# EAGLE design modem_arduino_relay (EAGLE 7.2.0)
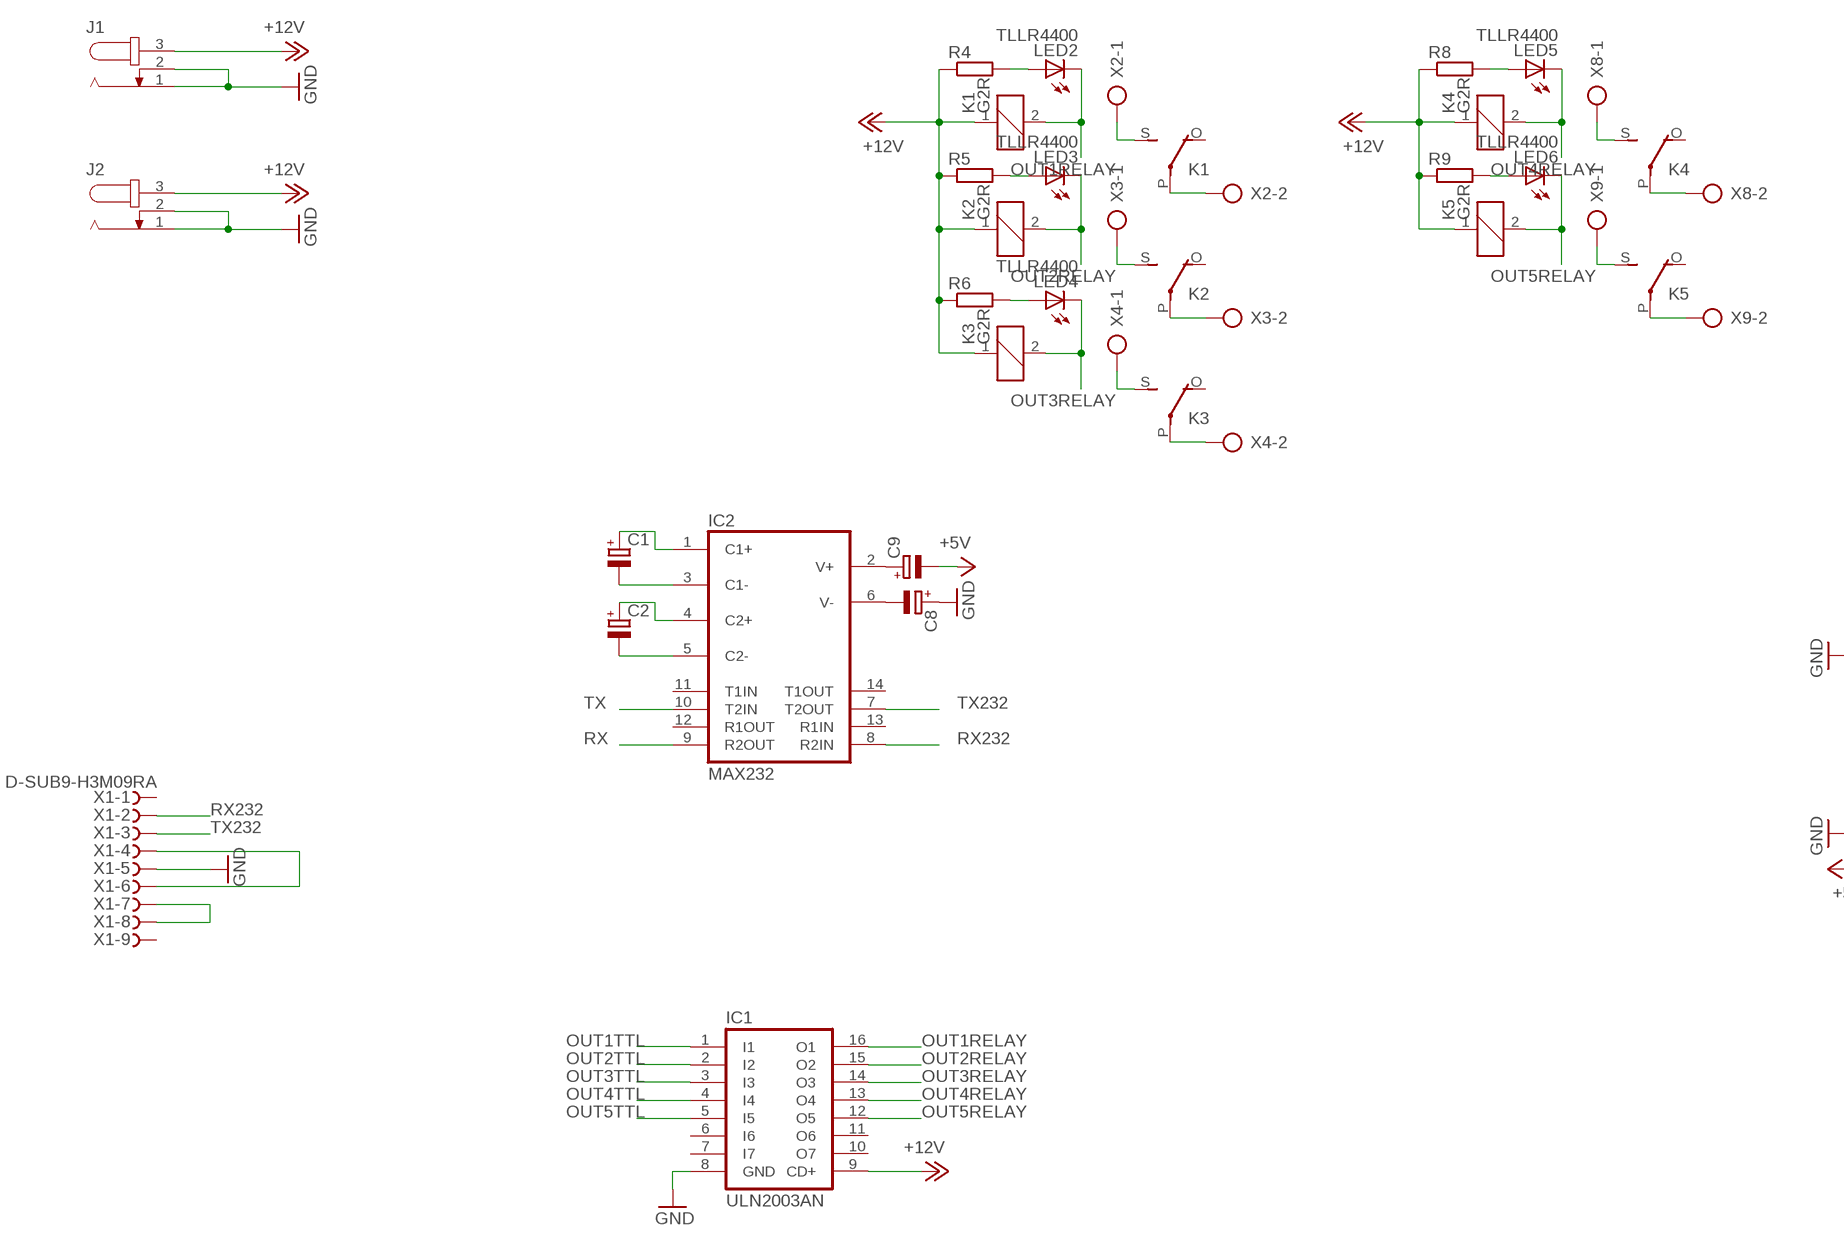
[diagram p0: schematic, sheet 1, part 1 of 2]
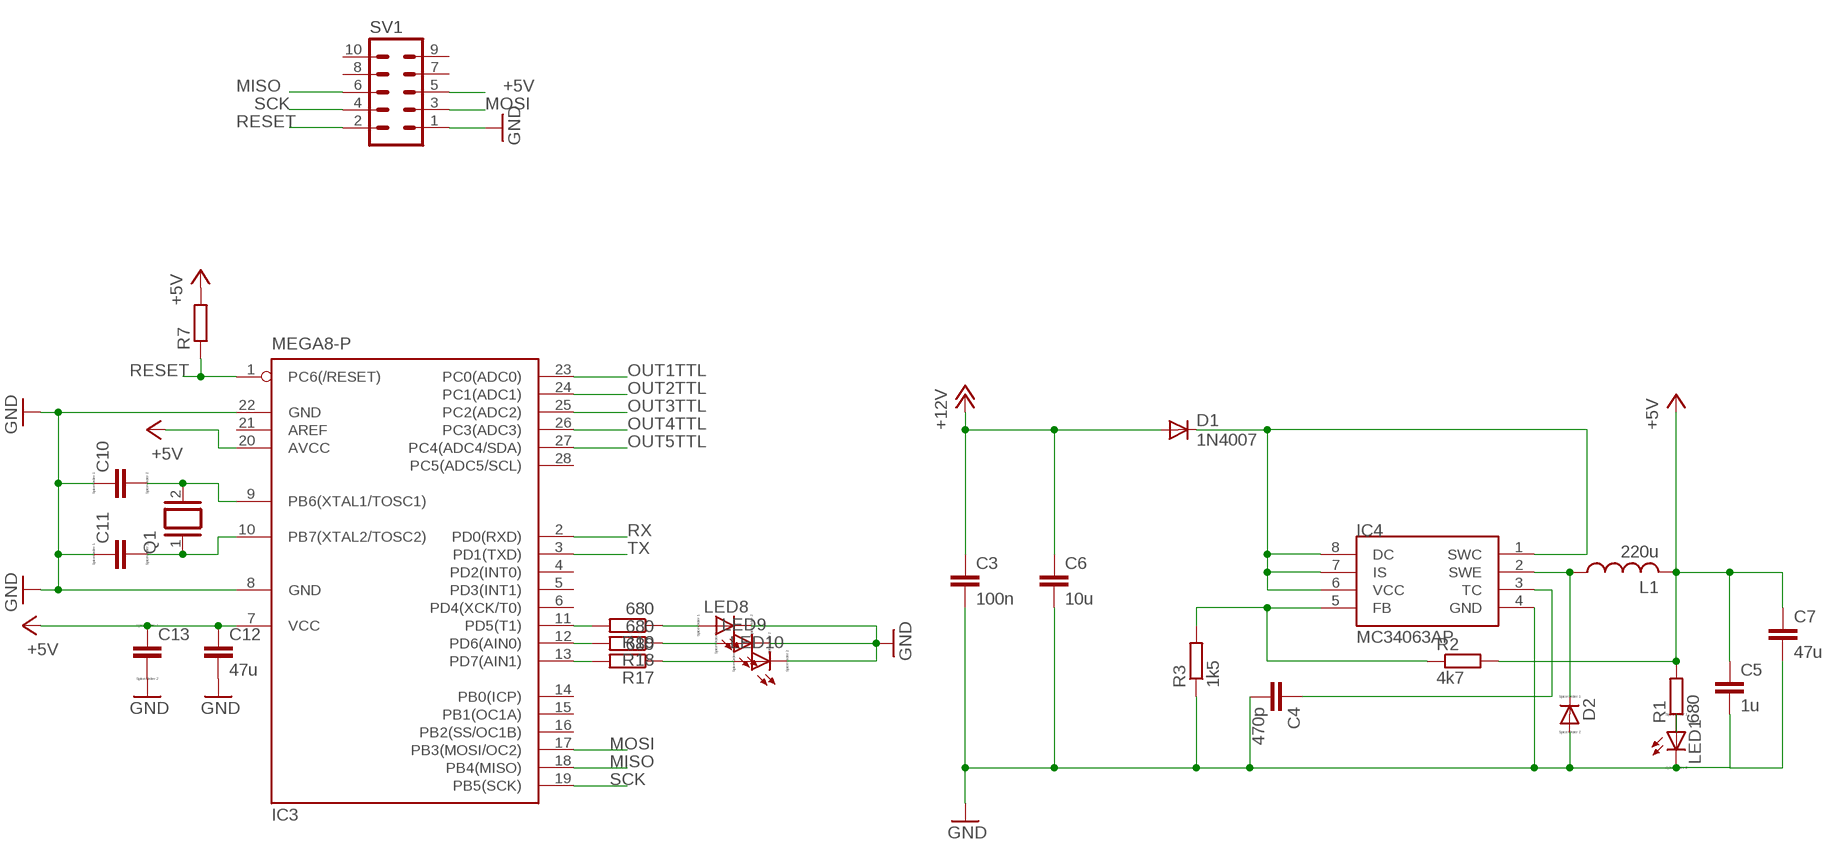
[diagram p1: schematic, sheet 1, part 2 of 2]

## Parts
C1  CPOL-EUE2.5-5  [E2,5-5]
C2  CPOL-EUE2.5-5  [E2,5-5]
C3  100n  C-EUC1206  [C1206]
C4  470p  C-EUC1206  [C1206]
C5  1u  C-EUC1206  [C1206]
C6  10u  C-EU050-024X044  [C050-024X044]
C7  47u  C-EU050-024X044  [C050-024X044]
C8  CPOL-EUE2.5-5  [E2,5-5]
C9  CPOL-EUE2.5-5  [E2,5-5]
C10  C-EUC1206  [C1206]
C11  C-EUC1206  [C1206]
C12  47u  C-EUC1812  [C1812]
C13  C-EUC1206  [C1206]
D1  1N4007  1N4004  [DO41-10]
D2  DIODE_E-SMC  [DIODE_SMC]
IC1  ULN2003AN  [DIL16]
IC2  MAX232  [DIL16]
IC3  MEGA8-P  [DIL28-3]
IC4  MC34063AP  [DIL08]
J1  JACK-PLUG1  [SPC4078]
J2  JACK-PLUG1  [SPC4078]
K1  G2R  [G2R]
K2  G2R  [G2R]
K3  G2R  [G2R]
K4  G2R  [G2R]
K5  G2R  [G2R]
L1  220u  L-USTJ3-U1  [TJ3-U1]
LED1  LED_ELD260  [LED_LD260]
LED2  TLLR4400  [LED3MM]
LED3  TLLR4400  [LED3MM]
LED4  TLLR4400  [LED3MM]
LED5  TLLR4400  [LED3MM]
LED6  TLLR4400  [LED3MM]
LED8  LED_ELD260  [LED_LD260]
LED9  LED_ELD260  [LED_LD260]
LED10  LED_ELD260  [LED_LD260]
Q1  XTAL/S  [QS]
R1  680  R-EU_M1206  [M1206]
R2  4k7  R-EU_0204/7  [0204/7]
R3  1k5  R-EU_0204/7  [0204/7]
R4  R-EU_M1206  [M1206]
R5  R-EU_M1206  [M1206]
R6  R-EU_M1206  [M1206]
R7  R-EU_M1206  [M1206]
R8  R-EU_M1206  [M1206]
R9  R-EU_M1206  [M1206]
R17  680  R-EU_M1206  [M1206]
R18  680  R-EU_M1206  [M1206]
R19  680  R-EU_M1206  [M1206]
SV1  MA05-2  [MA05-2]
X1  D-SUB9-H3M09RA  [H3M09RA]
X2  AK300/2  [AK300/2]
X3  AK300/2  [AK300/2]
X4  AK300/2  [AK300/2]
X8  AK300/2  [AK300/2]
X9  AK300/2  [AK300/2]

## Nets
+5V: C12.1 C13.1 IC3.7(VCC) IC3.20(AVCC) R7.2 SV1.5
+12V: C3.1 C6.1 D1.A IC1.9(CD+) J1.3 J2.3 K1.1 K2.1 K3.1 K4.1 K5.1 R4.1 R5.1 R6.1 R8.1 R9.1
GND: C3.2 C4.2 C5.2 C6.2 C7.2 C8.+ C10.1 C11.1 C12.2 C13.2 D2.A(C) IC1.8(GND) IC3.8(GND) IC3.22(GND) IC4.4(GND) J1.1 J1.2 J2.1 J2.2 LED1.K(C) LED8.K(C) LED9.K(C) LED10.K(C) R3.1 SV1.1 X1.5
MISO: IC3.18(PB4(MISO)) SV1.6
MOSI: IC3.17(PB3(MOSI/OC2)) SV1.3
N$1: C1.+ IC2.1(C1+)
N$2: C1.- IC2.3(C1-)
N$3: C2.+ IC2.4(C2+)
N$4: C2.- IC2.5(C2-)
N$5: D1.C IC4.1(SWC) IC4.6(VCC) IC4.7(IS) IC4.8(DC)
N$6: LED1.A R1.1
N$7: IC4.5(FB) R2.1 R3.2
N$8: C4.1 IC4.3(TC)
N$9: D2.C(A) IC4.2(SWE) L1.1
N$10: C8.- IC2.6(V-)
N$11: C9.+ IC2.2(V+)
N$12: C11.2 IC3.10(PB7(XTAL2/TOSC2)) Q1.1
N$13: K1.S(2:S) X2.1
N$14: K1.P(2:P) X2.2
N$15: C10.2 IC3.9(PB6(XTAL1/TOSC1)) Q1.2
N$16: K2.P(2:P) X3.2
N$17: K2.S(2:S) X3.1
N$18: K3.S(2:S) X4.1
N$19: K3.P(2:P) X4.2
N$20: LED2.A R4.2
N$21: LED4.A R6.2
N$22: LED3.A R5.2
N$24: K4.S(2:S) X8.1
N$25: K4.P(2:P) X8.2
N$26: K5.P(2:P) X9.2
N$27: K5.S(2:S) X9.1
N$31: IC3.11(PD5(T1)) R19.2
N$36: IC3.12(PD6(AIN0)) R18.2
N$37: IC3.13(PD7(AIN1)) R17.2
N$38: LED8.A R19.1
N$39: LED9.A R18.1
N$40: LED10.A R17.1
N$41: X1.7 X1.8
N$42: X1.4 X1.6
N$45: LED5.A R8.2
N$47: LED6.A R9.2
OUT1RELAY: IC1.16(O1) K1.2 LED2.K(C)
OUT1TTL: IC1.1(I1) IC3.23(PC0(ADC0))
OUT2RELAY: IC1.15(O2) K2.2 LED3.K(C)
OUT2TTL: IC1.2(I2) IC3.24(PC1(ADC1))
OUT3RELAY: IC1.14(O3) K3.2 LED4.K(C)
OUT3TTL: IC1.3(I3) IC3.25(PC2(ADC2))
OUT4RELAY: IC1.13(O4) K4.2 LED5.K(C)
OUT4TTL: IC1.4(I4) IC3.26(PC3(ADC3))
OUT5RELAY: IC1.12(O5) K5.2 LED6.K(C)
OUT5TTL: IC1.5(I5) IC3.27(PC4(ADC4/SDA))
RESET: IC3.1(PC6(/RESET)) R7.1 SV1.2
RX: IC2.9(R2OUT) IC3.2(PD0(RXD))
RX232: IC2.8(R2IN) X1.2
SCK: IC3.19(PB5(SCK)) SV1.4
TX: IC2.10(T2IN) IC3.3(PD1(TXD))
TX232: IC2.7(T2OUT) X1.3
VCC: C5.1 C7.1 C9.- L1.2 R1.2 R2.2 ; supply symbol labelled +5V
Unconnected: IC1.6(I6) IC1.7(I7) IC1.10(O7) IC1.11(O6) IC2.11(T1IN) IC2.12(R1OUT) IC2.13(R1IN) IC2.14(T1OUT) IC3.4(PD2(INT0)) IC3.5(PD3(INT1)) IC3.6(PD4(XCK/T0)) IC3.14(PB0(ICP)) IC3.15(PB1(OC1A)) IC3.16(PB2(SS/OC1B)) IC3.21(AREF) IC3.28(PC5(ADC5/SCL)) K1.O(2:O) K2.O(2:O) K3.O(2:O) K4.O(2:O) K5.O(2:O) SV1.7 SV1.8 SV1.9 SV1.10 X1.1 X1.9

## Power pins joined to a net without a drawn wire
GND: IC2.15(GND)
VCC: IC2.16(VCC)

## Library data of the parts
C1 C2 C8 C9 = rcl:CPOL-EU: POLARIZED CAPACITOR, European symbol
C3-C7 C12 = rcl:C-EU: CAPACITOR, European symbol
C10 C11 C13 = resistor:C-EU: CAPACITOR, European symbol; SPICEPREFIX: C
D1 = diode:1N4004: DIODE general purpose rectifier, 1 A
D2 = eagle-ltspice:DIODE_E-: Schottky Diode; SPICEMODEL: diode; SPICEPREFIX: D
IC1 = uln-udn:ULN2003A: DRIVER ARRAY
IC2 = maxim:MAX232: RS232 TRANSCEIVER; MF: MAXIM; MPN: MAX232ACPE+; OC_FARNELL: 9723773; OC_NEWARK: 68K4544
IC3 = atmel:MEGA8-P: MICROCONTROLLER 8 Kbytes FLASH, 1 kbytes SRAM, 512 bytes EEPROM, USART, 4-channel 10 bit ADC, 2-channel 8 bit ADC Pin compatible with Atmega48, ATMega88, ATMega168 Source: avr.lbr; OC_FARNELL: unknown; OC_NEWARK: unknown
IC4 = mc34063:MC34063
J1 J2 = con-jack:JACK-PLUG: DC POWER JACK Power Jack, DC, Right Angle, Through Hole, Rated 5A at 16VDC, PC Terminals Distributor: Farnell (www.Farnell.de) Drawing: 84N1161.pdf / 84N1162.pdf Manufacturer: SPC Technology (www.spctechnology.com) Type: SPC4077 / SPC 4078; OC_FARNELL: unknown; OC_NEWARK: unknown
K1-K5 = relay:G2R: RELAY 1 x switch, Omron; OC_FARNELL: 1569185; OC_NEWARK: unknown
L1 = rcl:L-US: INDUCTOR, American symbol
LED1 LED8-LED10 = eagle-ltspice:LED_E: LED Source: http://www.osram.convergy.de Source: www.luxeon.com Source: www.kingbright.com; SPICEMODEL: NONE; SPICEPREFIX: D; SPICETYPE: diode
LED2-LED6 = led:TLLR4400: Low Current (2mA) LED 3 mm Tinted Diffused Package color RED Source: Data sheet <http://www.farnell.com/datasheets/391100.pdf>; MF: VISHAY SEMICONDUCTOR; OC_FARNELL: 1612437
Q1 = special:XTAL/S: CRYSTAL
R1-R9 R17-R19 = rcl:R-EU_: RESISTOR, European symbol
SV1 = con-lstb:MA05-2: PIN HEADER; OC_FARNELL: unknown; OC_NEWARK: unknown
X1 = con-thomas-betts:D-SUB9-: D-Subminiatur Connector Source: Electronioc Interconnects European Edition 1998; OC_FARNELL: unknown; OC_NEWARK: unknown
X2-X4 X8 X9 = con-ptr500:AK300/2: CONNECTOR; OC_FARNELL: unknown; OC_NEWARK: unknown

## Board
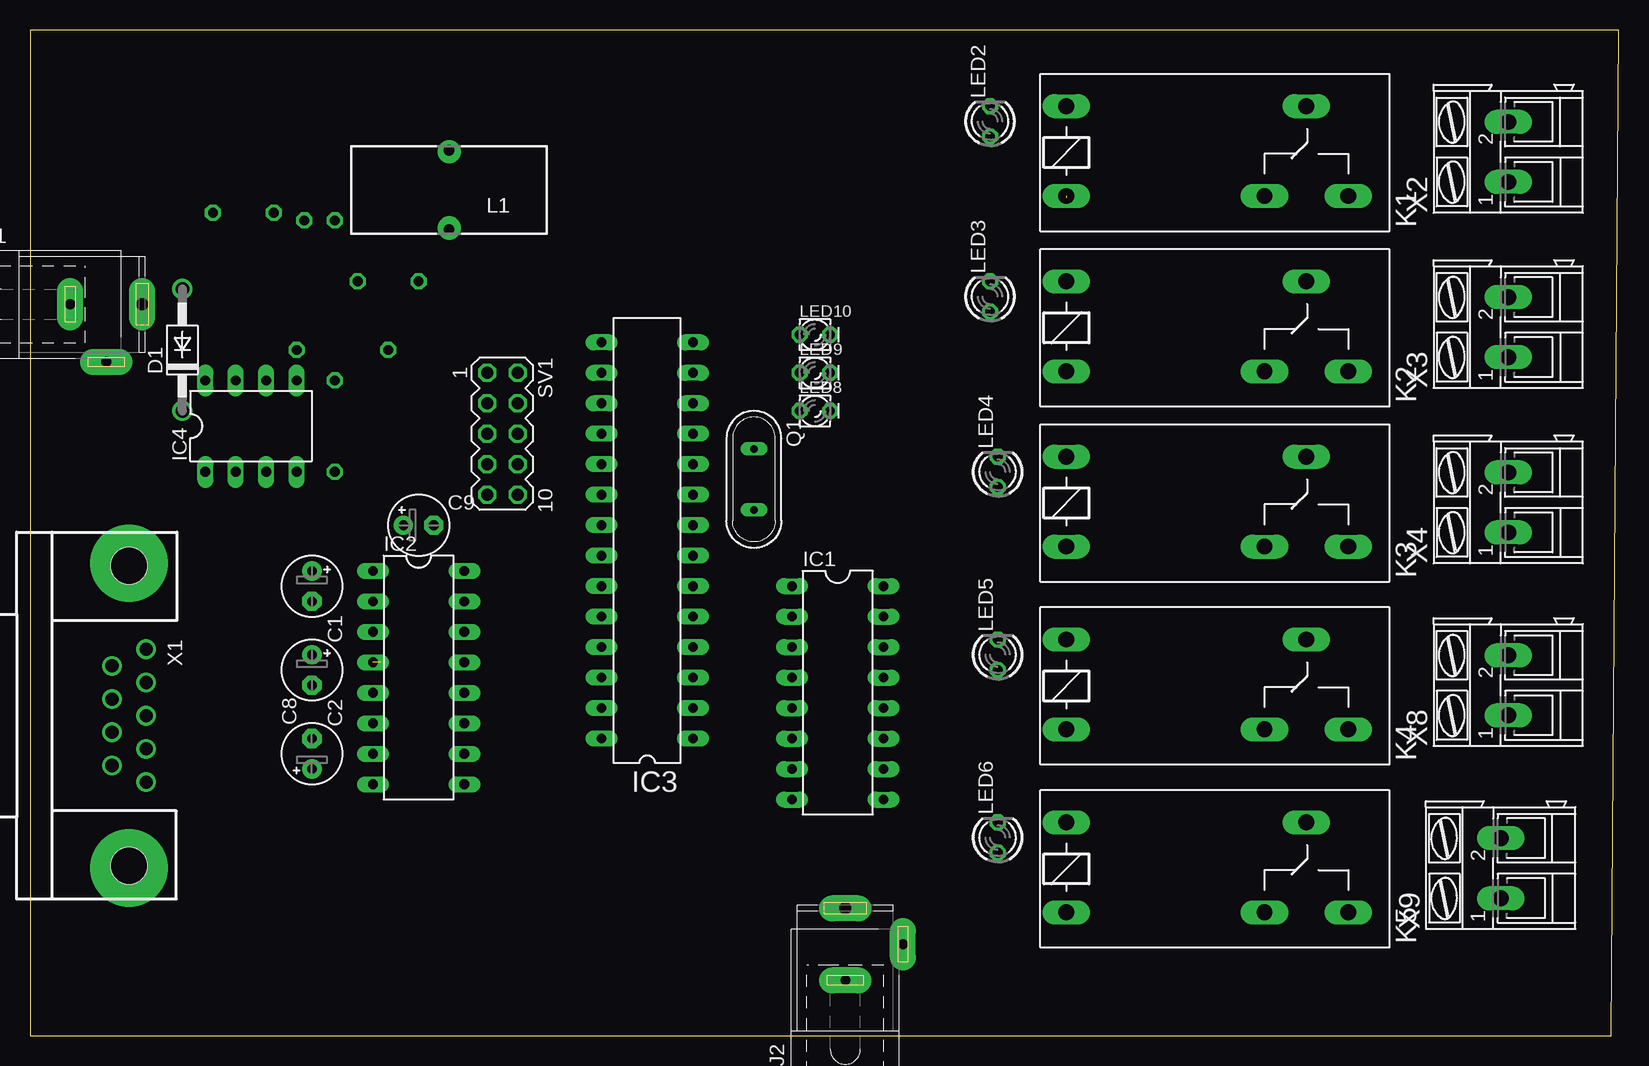
[diagram p2: board, top side]
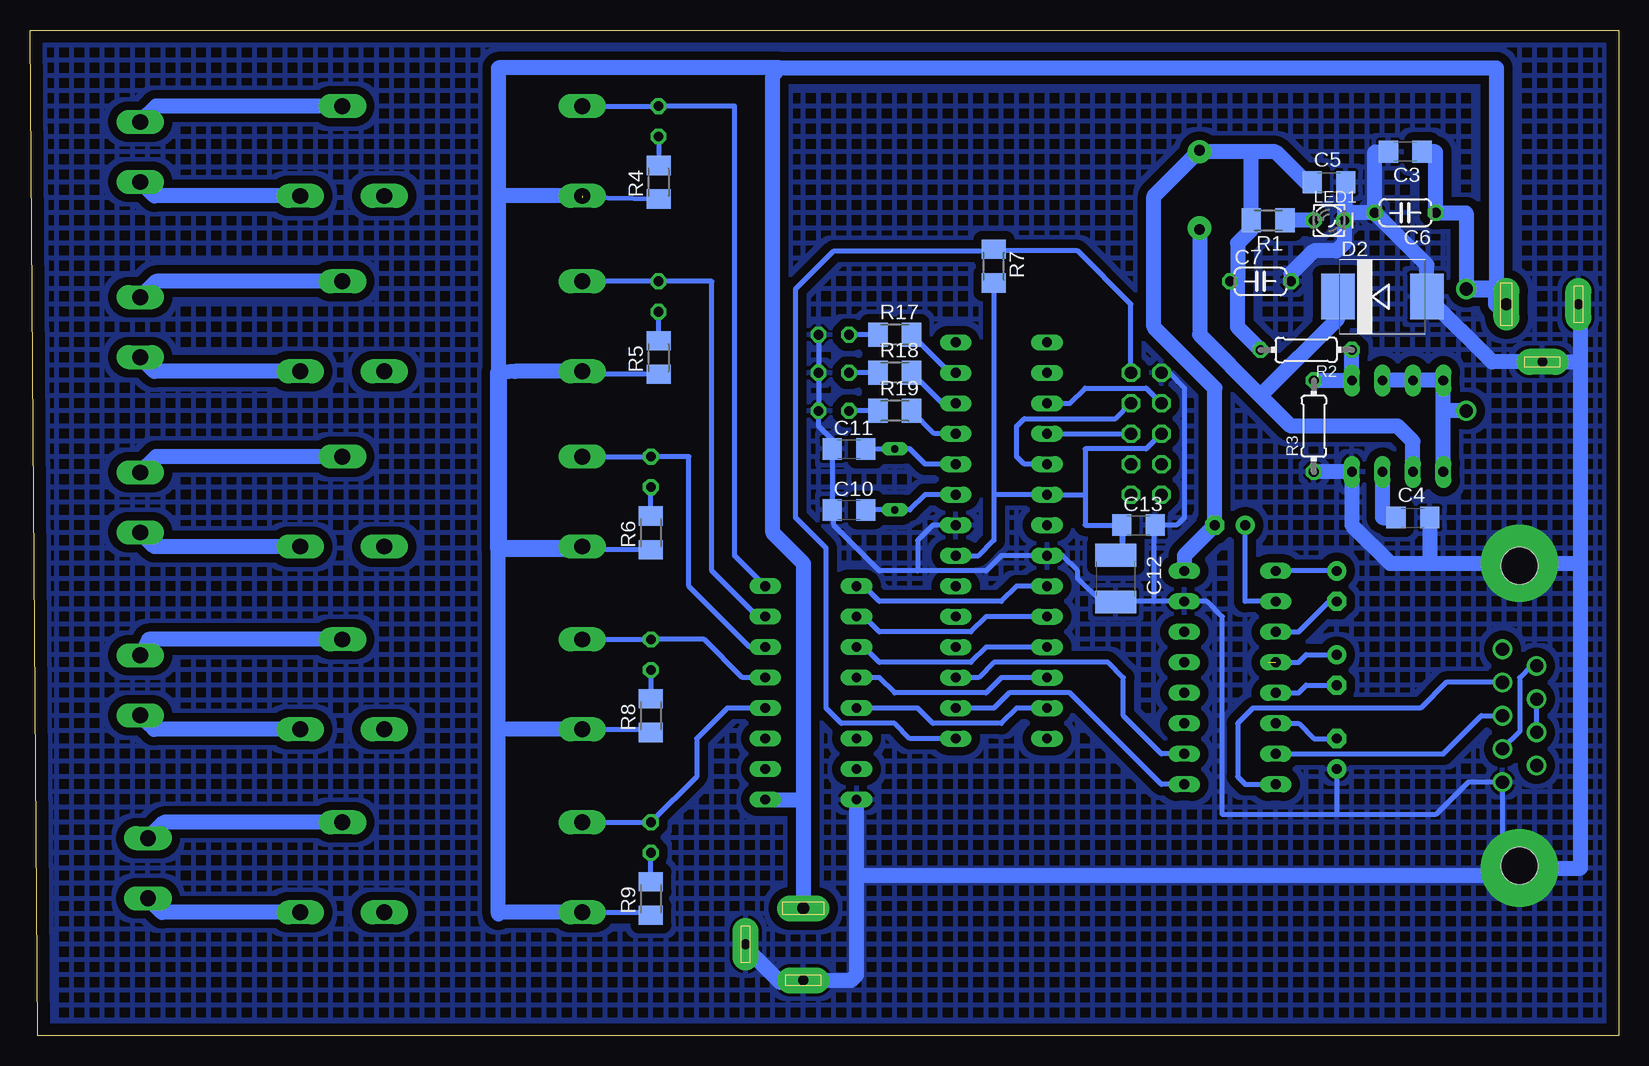
[diagram p3: board, bottom side, seen from below]

Size 132.38 x 83.81 mm. Coordinates in mm from the lower left corner, seen from the top.
Outline: 0,0 131.75,0 132.38,83.81 0,83.81 0,0
Copper layers (1*16): Top 0.035mm / dielectric 1.5mm / Bottom 0.035mm
Design rules "modem_arduino_relay *": minimum track width 10mil, minimum drill 24mil, track to track 0.705mm, track to pad 0.705mm, pad to pad 0.705mm, via to via 0.705mm, smd to smd 0.705mm, copper to edge 40mil, drill to drill 8mil, minimum pad ring 10mil, minimum via ring 8mil, stop-mask expansion 4mil, vias tented up to drill 0mil, thermal gap 10mil

### Footprints (pad centres in the part's own frame; a part is rotated, then mirrored left to right if it is on the bottom)
E2,5-5 = drill 0.813 pad 1.6: + -1.27,0 | drill 0.813 pad 1.6 octagon: - 1.27,0
C1206 = smd 1.6 x 1.8: 1 -1.4,0; 2 1.4,0
C050-024X044 = drill 0.813 octagon: 1 -2.54,0; 2 2.54,0
C1812 = smd 1.9 x 3.4: 1 -1.95,0; 2 1.95,0
DO41-10 = drill 1.118: A 5.08,0; C -5.08,0
DIODE_SMC = smd 2.8 x 3.8: A 3.7,0; C -3.7,0
DIL16 = drill 0.813 long: 1 -8.89,-3.81; 2 -6.35,-3.81; 3 -3.81,-3.81; 4 -1.27,-3.81; 5 1.27,-3.81; 6 3.81,-3.81; 7 6.35,-3.81; 8 8.89,-3.81; 9 8.89,3.81; 10 6.35,3.81; 11 3.81,3.81; 12 1.27,3.81; 13 -1.27,3.81; 14 -3.81,3.81; 15 -6.35,3.81; 16 -8.89,3.81
DIL28-3 = drill 0.813 long: 1 -16.51,-3.81; 2 -13.97,-3.81; 3 -11.43,-3.81; 4 -8.89,-3.81; 5 -6.35,-3.81; 6 -3.81,-3.81; 7 -1.27,-3.81; 8 1.27,-3.81; 9 3.81,-3.81; 10 6.35,-3.81; 11 8.89,-3.81; 12 11.43,-3.81; 13 13.97,-3.81; 14 16.51,-3.81; 15 16.51,3.81; 16 13.97,3.81; 17 11.43,3.81; 18 8.89,3.81; 19 6.35,3.81; 20 3.81,3.81; 21 1.27,3.81; 22 -1.27,3.81; 23 -3.81,3.81; 24 -6.35,3.81; 25 -8.89,3.81; 26 -11.43,3.81; 27 -13.97,3.81; 28 -16.51,3.81
DIL08 = drill 0.813 long: 1 -3.81,-3.81; 2 -1.27,-3.81; 3 1.27,-3.81; 4 3.81,-3.81; 5 3.81,3.81; 6 1.27,3.81; 7 -1.27,3.81; 8 -3.81,3.81
SPC4078 = drill 0.8 pad 2.184 long: 1 -3,0; 2 0,-4.8 | drill 1 pad 2.184 long: 3 3,0
G2R = drill 1.321 long: 1 -2.54,-3.683; 2 -2.54,3.81; O 13.97,-3.683; P 17.45,3.81; S 20.955,-3.683
TJ3-U1 = drill 0.9: 1 -3.3,0; 2 3.3,0
LED_LD260 = drill 0.813 octagon: A -1.27,0; K 1.27,0
LED3MM = drill 0.813 octagon: A -1.27,0; K 1.27,0
QS = drill 0.61 long: 1 -2.54,0; 2 2.54,0
M1206 = smd 1.6 x 2: 1 -1.4,0; 2 1.4,0
0204/7 = drill 0.813 octagon: 1 -3.81,0; 2 3.81,0
MA05-2 = drill 1.016 octagon: 1 -5.08,-1.27; 2 -5.08,1.27; 3 -2.54,-1.27; 4 -2.54,1.27; 5 0,-1.27; 6 0,1.27; 7 2.54,-1.27; 8 2.54,1.27; 9 5.08,-1.27; 10 5.08,1.27
H3M09RA = drill 1.092: 1 -5.537,1.422; 2 -2.769,1.422; 3 0,1.422; 4 2.769,1.422; 5 5.537,1.422; 6 -4.153,-1.422; 7 -1.384,-1.422; 8 1.384,-1.422; 9 4.153,-1.422 | hole 3.048: -12.497,0; 12.497,0
AK300/2 = drill 1.321 long: 1 -2.515,0; 2 2.489,0

### Placement (x,y rotation side)
C1  23.5,37.46 270 top
C2  23.5,30.48 270 top
C3  17.78,73.66 180 bottom
C4  17.14,43.18 0 bottom
C5  24.13,71.12 0 bottom
C6  17.78,68.58 180 bottom
C7  29.84,62.87 0 bottom
C8  23.5,23.5 90 top
C9  32.38,42.54 0 top
C10  64.14,43.81 0 bottom
C11  64.14,48.89 0 bottom
C12  41.91,38.1 270 bottom
C13  40.01,42.54 0 bottom
D1  12.7,57.15 90 top
D2  19.69,61.59 0 bottom
IC1  67.31,28.57 270 top
IC2  32.38,29.84 270 top
IC3  51.44,41.27 90 top
IC4  18.41,50.8 0 top
J1  6.35,60.96 0 top
J2  67.95,7.62 90 top
K1  88.9,73.66 0 top
K2  88.9,59.05 0 top
K3  88.9,44.45 0 top
K4  88.9,29.21 0 top
K5  88.9,13.97 0 top
L1  34.92,70.48 90 top
LED1  24.13,67.95 0 bottom
LED2  80.01,76.2 90 top
LED3  80.01,61.59 90 top
LED4  80.64,46.99 90 top
LED5  80.64,31.75 90 top
LED6  80.64,16.51 90 top
LED8  65.41,52.07 0 top
LED9  65.41,55.24 0 top
LED10  65.41,58.42 0 top
Q1  60.33,46.35 270 top
R1  29.21,67.95 180 bottom
R2  26.04,57.15 180 bottom
R3  25.4,50.8 90 bottom
R4  80.01,71.12 90 bottom
R5  80.01,56.51 90 bottom
R6  80.64,41.91 90 bottom
R7  52.07,64.14 270 bottom
R8  80.64,26.67 90 bottom
R9  80.64,11.43 90 bottom
R17  60.33,58.42 0 bottom
R18  60.33,55.24 0 bottom
R19  60.33,52.07 0 bottom
SV1  39.37,50.16 270 top
X1  8.25,26.67 270 top
X2  123.19,73.66 90 top
X3  123.19,59.05 90 top
X4  123.19,44.45 90 top
X8  123.19,29.21 90 top
X9  122.55,13.97 90 top

### Tracks (layer width: path | path; a pad name or v marks a point on that pad's centre or on a via)
+5V
  Bottom 0.406: IC3.7 53.34,40 52.07,41.27 52.07,45.08 | R7.2 52.07,45.08 | SV1.5 39.37,48.89 44.45,48.89 44.45,45.08 | 41.27,42.54 41.27,40 41.32,40.05 C12.1 41.41,40.55 C13.1 44.45,42.54 44.45,45.08 | 44.45,45.08 IC3.20 52.07,45.08
+12V  (1 unrouted)
  Bottom 0.406: R4.1 86.36,69.85 | R6.1 86.1,40.51 K3.1 | R5.1 86.1,55.11 K2.1 | K5.1 80.9,10.29 R9.1 | K4.1 80.9,25.53 R8.1
  Bottom 1.27: D1.A 12.7,68.58 C6.1 15.24,73.66 C3.1 | 10.16,62.23 10.16,80.65 69.85,80.65 | 69.85,80.65 93.34,80.65 93.34,69.85 | 93.34,69.85 93.34,55.24 91.95,55.37 K2.1 | 69.85,80.65 70.48,80.01 70.48,41.91 67.95,39.37 67.95,19.68 | 93.34,25.4 93.34,10.16 93.22,10.29 K5.1 | 93.34,25.4 93.34,40.64 | K4.1 93.22,25.53 93.34,25.4 | IC1.9 67.95,19.68 | K1.1 93.22,69.98 93.34,69.85 | 67.95,19.68 J2.3
  Bottom 1.422: J1.3 10.16,60.96 10.16,62.23 D1.A | 93.34,55.24 93.34,40.64 86.36,40.64 K3.1
GND  (via drill 0.6 pad 6.45)
  Bottom 0.406: 23.5,18.41 15.24,18.41 12.52,21.13 X1.5 9.68,15.39 v8.25,13.97 | 23.5,18.41 33.02,18.41 33.02,34.92 34.29,36.2 IC2.15 38.73,36.2 | 58.42,38.73 52.7,38.73 51.44,40 IC3.22 46.36,40 45.09,38.73 45.09,38.1 43.13,36.15 C12.2 41.87,36.2 38.73,36.2 | IC3.8 57.15,42.54 58.42,41.27 58.42,38.73 | 58.42,38.73 61.59,38.73 65.41,42.54 65.41,43.68 C10.1 C11.1 65.53,49.66 66.67,50.8 LED8.K LED9.K LED10.K | SV1.1 37.47,55.24 36.2,53.97 36.2,43.18 36.83,42.54 C13.2 38.73,42.54 38.73,36.2 | C8.+ 23.5,18.41
  Bottom 1.27: 22.83,68.61 LED1.K 22.86,66.04 23.5,65.41 25.4,65.41 27.3,63.5 C7.2 | 22.83,68.61 22.71,71.14 C5.2 | 3.17,39.37 3.17,13.97 v8.25,13.97 8.89,13.34 63.5,13.34 | 3.17,39.37 v8.25,39.37 15.88,39.37 | 3.17,39.37 3.17,55.88 | 3.17,55.88 3.17,60.78 J1.1 | 15.88,39.37 19.05,39.37 22.23,42.54 IC4.4 R3.1 | C4.2 15.75,39.5 15.88,39.37 | 3.17,55.88 3.45,56.16 J1.2 10.55,56.16 D2.A 15.98,64.25 C6.2 | 63.5,13.34 IC1.8 | C6.2 20.32,73.66 C3.2 | C6.2 22.8,68.58 22.83,68.61 | 63.5,13.34 63.5,5.08 63.96,4.62 J2.1 68.12,4.45 69.85,4.45 72.75,7.34 J2.2
  pour Bottom (hatched): 0.63,85.09 132.08,85.09 132.08,0 0,0
MISO
  Bottom 0.406: IC3.18 SV1.6
MOSI
  Bottom 0.406: IC3.17 45.72,52.7 44.45,53.97 39.37,53.97 SV1.3
N$1
  Bottom 0.406: C1.+ IC2.1
N$2
  Bottom 0.406: IC2.3 26.67,33.65 24.13,36.2 C1.-
N$3  (1 unrouted)
  Bottom 0.406: 29.21,31.11 26.67,31.11 26.04,31.75 C2.+
N$4
  Bottom 0.406: IC2.5 26.67,28.57 26.04,29.21 C2.-
N$5
  Bottom 1.27: IC4.6 IC4.7 IC4.8 14.61,52.07 | IC4.1 14.61,52.07 | D1.C 14.61,52.07
N$6
  Bottom 1.27: LED1.A R1.1
N$7
  Bottom 1.27: R2.1 IC4.5 R3.2
N$8
  Bottom 1.27: IC4.3 19.69,43.18 C4.1
N$9
  Bottom 1.27: IC4.2 17.14,49.53 18.41,50.8 27.3,50.8 29.84,53.34 | L1.1 34.92,58.42 29.84,53.34 | 29.84,53.34 23.39,59.8 D2.C
N$10
  Bottom 0.406: IC2.6 26.67,26.04 25.4,24.77 C8.-
N$11
  Bottom 0.406: IC2.2 31.12,36.2 C9.+
N$12
  Bottom 0.406: IC3.10 57.78,47.62 59.06,48.89 Q1.1 C11.2
N$13
  Bottom 1.27: K1.S 122.02,69.98 X2.1
N$14
  Bottom 1.27: K1.P 121.87,77.47 X2.2
N$15
  Bottom 0.406: IC3.9 57.78,45.08 59.06,43.81 Q1.2 C10.2
N$16
  Bottom 1.27: K2.P 121.87,62.87 X3.2
N$17
  Bottom 1.27: K2.S 122.02,55.37 X3.1
N$18
  Bottom 1.27: K3.S 122.02,40.77 X4.1
N$19
  Bottom 1.27: K3.P 121.87,48.26 X4.2
N$20
  Bottom 0.406: LED2.A R4.2
N$21
  Bottom 0.406: R6.2 LED4.A
N$22
  Bottom 0.406: R5.2 LED3.A
N$24
  Bottom 1.27: K4.S 122.05,25.53 122.55,26.04 122.55,26.06 X8.1
N$25
  Bottom 1.27: K4.P 122.5,33.02 X8.2
N$26
  Bottom 1.27: K5.P 121.23,17.78 X9.2
N$27
  Bottom 1.27: K5.S 121.39,10.29 X9.1
N$31
  Bottom 0.406: IC3.11 57.02,50.16 R19.2
N$36
  Bottom 0.406: IC3.12 56.38,52.7 R18.2
N$37
  Bottom 0.406: IC3.13 55.75,55.24 R17.2
N$38
  Bottom 0.406: R19.1 LED8.A
N$39
  Bottom 0.406: R18.1 LED9.A
N$40
  Bottom 0.406: R17.1 LED10.A
N$41
  Bottom 0.406: X1.8 X1.7
N$42
  Bottom 0.406: X1.6 7.28,30.82 8.25,29.84 8.25,25.32 X1.4
N$43  (via drill 0.6 pad 1.93)
  other vias: 34.92,67.31
N$44  (via drill 0.6 pad 1.93)
  other vias: 34.92,73.66
N$45
  Bottom 0.406: LED5.A R8.2
N$47
  Bottom 0.406: R9.2 LED6.A
OUT1RELAY
  Bottom 0.406: IC1.16 73.66,40 73.66,77.47 LED2.K K1.2
OUT1TTL
  Bottom 0.406: IC3.23 50.16,37.46 51.44,36.2 61.59,36.2 62.86,37.46 IC1.1
OUT2RELAY
  Bottom 0.406: K2.2 LED3.K 75.56,62.87 75.56,38.73 71.75,34.92 IC1.15
OUT2TTL
  Bottom 0.406: IC3.24 52.7,34.92 53.98,33.65 61.59,33.65 62.86,34.92 IC1.2 64.14,34.92
OUT3RELAY
  Bottom 0.406: IC1.14 72.39,32.38 77.47,37.46 77.47,48.26 LED4.K K3.2
OUT3TTL
  Bottom 0.406: IC3.25 52.7,32.38 53.98,31.11 61.59,31.11 62.86,32.38 IC1.3
OUT4RELAY
  Bottom 0.406: IC1.13 73.03,29.84 76.2,33.02 LED5.K K4.2
OUT4TTL
  Bottom 0.406: IC1.4 61.59,29.84 60.33,28.57 52.7,28.57 51.44,29.84 IC3.26
OUT5RELAY
  Bottom 0.406: K5.2 LED6.K 76.83,21.59 76.83,24.77 74.3,27.3 IC1.12
OUT5TTL
  Bottom 0.406: IC3.27 50.16,27.3 51.44,26.04 57.15,26.04 58.42,27.3 IC1.5
RESET
  Bottom 0.406: SV1.2 40.64,60.96 45.09,65.41 51.3,65.41 R7.1 52.2,65.41 65.41,65.41 68.58,62.23 68.58,43.18 66.04,40.64 66.04,27.3 64.77,26.04 60.33,26.04 59.06,24.77 IC3.1
RX
  Bottom 0.406: IC2.9 38.1,20.96 45.72,28.57 50.8,28.57 52.07,27.3 IC3.2
RX232
  Bottom 0.406: X1.2 14.38,29.44 16.51,27.3 30.48,27.3 31.75,26.04 31.75,21.59 31.12,20.96 IC2.8
SCK
  Bottom 0.406: IC3.19 49.53,47.62 50.16,48.26 50.16,50.8 49.53,51.43 41.91,51.43 SV1.4
TX
  Bottom 0.406: IC2.10 38.1,23.5 41.27,26.67 41.27,29.84 42.55,31.11 52.07,31.11 53.34,29.84 IC3.3
TX232
  Bottom 0.406: 9.68,26.52 X1.3 11.43,26.67 14.61,23.5 IC2.7
VCC
  Bottom 1.27: C5.1 26.04,71.12 28.58,73.66 30.48,73.66 | 30.48,73.66 34.8,73.66 L1.2 38.73,69.98 38.73,59.05 33.66,53.97 C9.- 36.2,40 IC2.16 | 30.48,73.66 30.61,73.53 R1.2 30.61,67.18 31.75,66.04 31.75,63.01 C7.1 31.75,62.72 31.75,59.05 R2.2